# EAGLE design peltier (EAGLE 7.5.0)
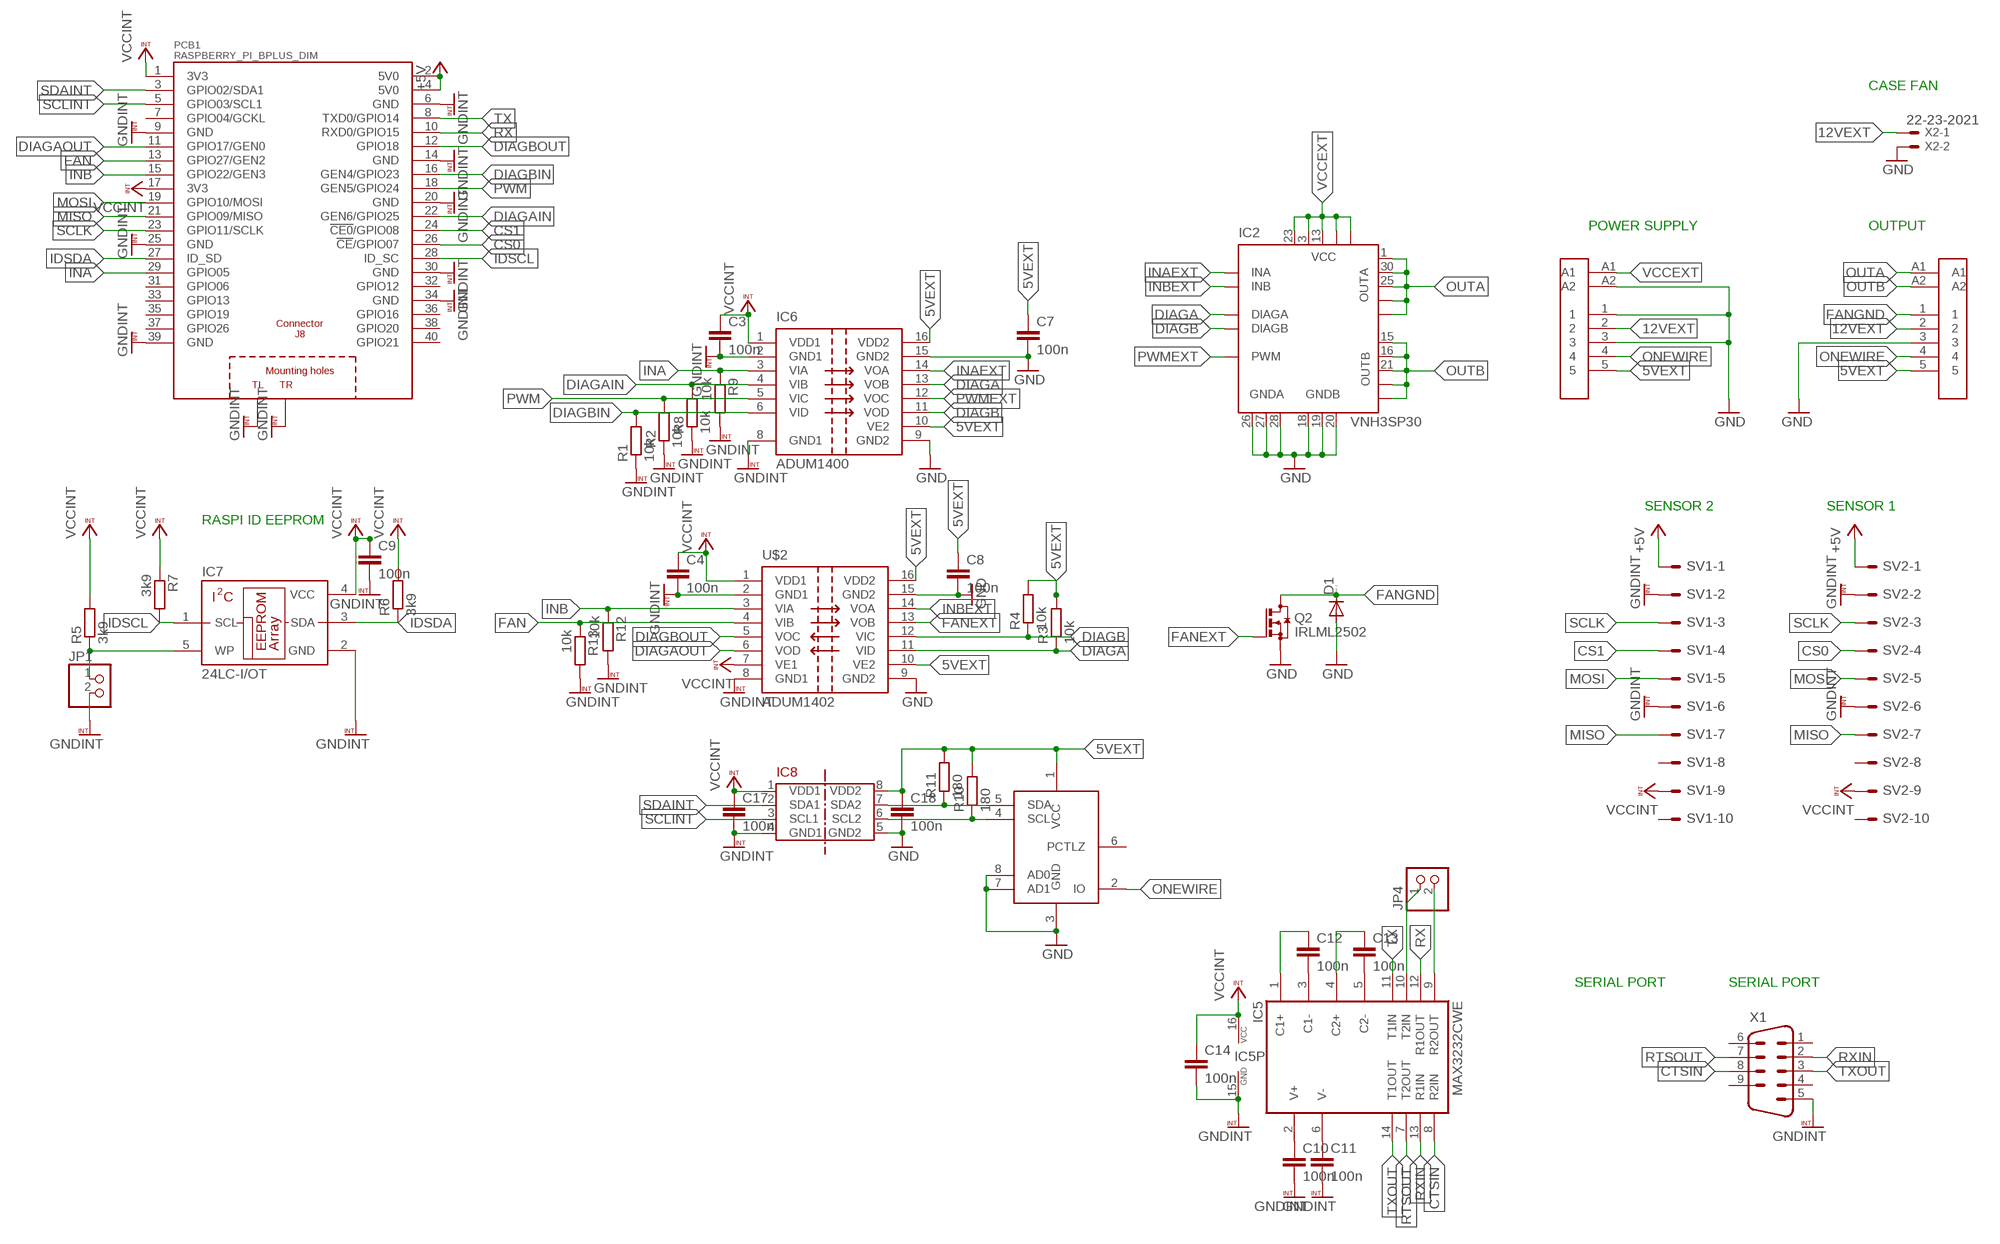
[diagram p0: schematic, sheet 1]

## Parts
C3  100n  C-EUC0805  [C0805]
C4  100n  C-EUC0805  [C0805]
C7  100n  C-EUC0805  [C0805]
C8  100n  C-EUC0805  [C0805]
C9  100n  C-EUC0805  [C0805]
C10  100n  C-EUC0805  [C0805]
C11  100n  C-EUC0805  [C0805]
C12  100n  C-EUC0805  [C0805]
C13  100n  C-EUC0805  [C0805]
C14  100n  C-EUC0805  [C0805]
C17  100n  C-EUC0805  [C0805]
C18  100n  C-EUC0805  [C0805]
D1  DIODE-MINIMELF  [MINIMELF]
IC2  VNH3SP30  [MULTIPOWERSO-30]
IC5  MAX3232CWE  [SO16L]
IC6  ADUM1400  [SO16W]
IC7  24LC-I/OT  [SOT23-5]
IC8  ADUM1250  [SO08]
JP1  PINHD-1X2  [1X02]
JP4  PINHD-1X2  [1X02]
PCB1  RASPBERRY_PI_BPLUS_DIM  [RASPBERRY_PI_BPLUS_DIM]
Q2  IRLML2502  BSS123  [SOT23]
R1  10k  R-EU_R0603  [R0603]
R2  10k  R-EU_R0603  [R0603]
R3  10k  R-EU_R0805  [R0805]
R4  10k  R-EU_R0805  [R0805]
R5  3k9  R-EU_R0805  [R0805]
R6  3k9  R-EU_R0805  [R0805]
R7  3k9  R-EU_R0805  [R0805]
R8  10k  R-EU_R0603  [R0603]
R9  10k  R-EU_R0603  [R0603]
R10  180  R-EU_R0805  [R0805]
R11  180  R-EU_R0805  [R0805]
R12  10k  R-EU_R0603  [R0603]
R13  10k  R-EU_R0603  [R0603]
SV1  ML10E  [ML10]
SV2  ML10E  [ML10]
U$2  ADUM1402  [SO16W]
U$4  7W2-F  [7W2-F]
U$6  7W2-M  [7W2-M]
U$15  DS2483-100  [SO-08]
X1  M09HP  [M09HP]
X2  22-23-2021  [22-23-2021]

## Nets
5VEXT: C7.1 C8.1 C18.1 IC6.10(VE2) IC6.16(VDD2) IC8.8(VDD2) R3.2 R4.2 R10.2 R11.2 U$2.10(VE2) U$2.16(VDD2) U$4.5 U$6.5 U$15.1(VCC)
12VEXT: U$4.2 U$6.2 X2.1
+5V: PCB1.2(5V0) PCB1.4(5V0) SV1.1 SV2.1
CS0: PCB1.26(!CE!/GPIO07) SV2.4
CS1: PCB1.24(!CE0!/GPIO08) SV1.4
CTSIN: IC5.8(R2IN) X1.8
DIAGA: IC2.6(DIAGA) IC6.13(VOB) R3.1 U$2.11(VID)
DIAGAIN: IC6.4(VIB) PCB1.22(GEN6/GPIO25) R8.2
DIAGAOUT: PCB1.11(GPIO17/GEN0) U$2.6(VOD)
DIAGB: IC2.10(DIAGB) IC6.11(VOD) R4.1 U$2.12(VIC)
DIAGBIN: IC6.6(VID) PCB1.16(GEN4/GPIO23) R1.2
DIAGBOUT: PCB1.12(GPIO18) U$2.5(VOC)
FAN: PCB1.13(GPIO27/GEN2) R13.1 U$2.4(VIB)
FANEXT: Q2.1(G) U$2.13(VOB)
FANGND: D1.C Q2.3(D) U$4.1
GND: C7.2 C8.2 C18.2 D1.A IC2.18(GNDB) IC2.19(GNDB) IC2.20(GNDB) IC2.26(GNDA) IC2.27(GNDA) IC2.28(GNDA) IC6.9(GND2) IC6.15(GND2) IC8.5(GND2) Q2.2(S) U$2.9(GND2) U$2.15(GND2) U$4.3 U$6.1 U$6.3 U$6.A2 U$15.3(GND) U$15.7(AD1) U$15.8(AD0) X2.2
GNDINT: C3.2 C4.2 C9.2 C10.2 C11.2 C14.2 C17.2 IC5.15(GND) IC6.2(GND1) IC6.8(GND1) IC7.2(GND) IC8.4(GND1) JP1.2 PCB1.6(GND) PCB1.9(GND) PCB1.14(GND) PCB1.20(GND) PCB1.25(GND) PCB1.30(GND) PCB1.34(GND) PCB1.39(GND) PCB1.PE_TL(TL) PCB1.PE_TR(TR) R1.1 R2.1 R8.1 R9.2 R12.2 R13.2 SV1.2 SV1.6 SV2.2 SV2.6 U$2.2(GND1) U$2.8(GND1) X1.5
IDSCL: IC7.1(SCL) PCB1.28(ID_SC) R7.2
IDSDA: IC7.3(SDA) PCB1.27(ID_SD) R6.1
INA: IC6.3(VIA) PCB1.29(GPIO05) R9.1
INAEXT: IC2.5(INA) IC6.14(VOA)
INB: PCB1.15(GPIO22/GEN3) R12.1 U$2.3(VIA)
INBEXT: IC2.11(INB) U$2.14(VOA)
MISO: PCB1.21(GPIO09/MISO) SV1.7 SV2.7
MOSI: PCB1.19(GPIO10/MOSI) SV1.5 SV2.5
N$28: IC7.5(WP) JP1.1 R5.1
N$59: C10.1 IC5.2(V+)
N$60: C11.1 IC5.6(V-)
N$61: C12.1 IC5.1(C1+)
N$62: C12.2 IC5.3(C1-)
N$63: C13.1 IC5.4(C2+)
N$64: C13.2 IC5.5(C2-)
N$68: IC5.9(R2OUT) JP4.2
N$69: IC5.10(T2IN) JP4.1
N$74: IC8.7(SDA2) R11.1 U$15.5(SDA)
N$75: IC8.6(SCL2) R10.1 U$15.4(SCL)
ONEWIRE: U$4.4 U$6.4 U$15.2(IO)
OUTA: IC2.1(OUTA) IC2.25(OUTA) IC2.30(OUTA) IC2.OUTA IC2.OUTA@1(OUTA) U$4.A1
OUTB: IC2.15(OUTB) IC2.16(OUTB) IC2.21(OUTB) IC2.OUTB IC2.OUTB@1(OUTB) U$4.A2
PWM: IC6.5(VIC) PCB1.18(GEN5/GPIO24) R2.2
PWMEXT: IC2.8(PWM) IC6.12(VOC)
RTSOUT: IC5.7(T2OUT) X1.7
RX: IC5.12(R1OUT) PCB1.10(RXD0/GPIO15)
RXIN: IC5.13(R1IN) X1.2
SCLINT: IC8.3(SCL1) PCB1.5(GPIO03/SCL1)
SCLK: PCB1.23(GPIO11/SCLK) SV1.3 SV2.3
SDAINT: IC8.2(SDA1) PCB1.3(GPIO02/SDA1)
TX: IC5.11(T1IN) PCB1.8(TXD0/GPIO14)
TXOUT: IC5.14(T1OUT) X1.3
VCCEXT: IC2.3(VCC) IC2.13(VCC) IC2.23(VCC) IC2.VCC IC2.VCC@1(VCC) U$6.A1
VCCINT: C3.1 C4.1 C9.1 C14.1 C17.1 IC5.16(VCC) IC6.1(VDD1) IC7.4(VCC) IC8.1(VDD1) PCB1.1(3V3) PCB1.17(3V3) R5.2 R6.2 R7.1 SV1.9 SV2.9 U$2.1(VDD1) U$2.7(VE1)
Unconnected: PCB1.7(GPIO04/GCKL) PCB1.31(GPIO06) PCB1.32(GPIO12) PCB1.33(GPIO13) PCB1.35(GPIO19) PCB1.36(GPIO16) PCB1.37(GPIO26) PCB1.38(GPIO20) PCB1.40(GPIO21) SV1.8 SV1.10 SV2.8 SV2.10 U$15.6(PCTLZ) X1.1 X1.4 X1.6 X1.9

## Notes on the sheet
- CASE FAN
- POWER SUPPLY | OUTPUT
- SENSOR 2 | SENSOR 1
- RASPI ID EEPROM
- SERIAL PORT | SERIAL PORT

## Library data of the parts
C3 C4 C7-C14 C17 C18 = rcl:C-EU: CAPACITOR, European symbol
D1 = diode:DIODE-: DIODE
IC2 = custom:VNH3SP30: FULLY INTEGRATED H-BRIDGE MOTOR DRIVER Source: http://pdf1.alldatasheet.com/datasheet-pdf/view/84563/STMICROELECTRONICS/VNH3SP30.html; MPN: VNH3SP30-E; OC_FARNELL: 1739420; OC_NEWARK: 33R1486
IC5 = maxim:MAX3232*: True RS-232 Transceivers 3.0V to 5.5V, Low-Power up to 1Mbps, Using Four 0.1µF External Capacitors Source: http://pdfserv.maxim-ic.com/en/ds/MAX3222-MAX3241.pdf; MF: MAXIM; MPN: MAX3232CWE+; OC_FARNELL: 9725504; OC_NEWARK: 68K4630
IC6 = adum140x:ADUM1400
IC7 = we-chip:24LC*: Microchip I2C EEPROM 2 Kbit - 24LC02B - 24LC02BT-I/OTDKR-ND 32 Kbit- 24LC32A - 24LC32AT-I/OTDKR-ND; DIGIKEY: 24LC32AT-I/OTDKR-ND
IC8 = Bus-isolators:ADUM1250
JP1 JP4 = pinhead:PINHD-1X2: PIN HEADER
PCB1 = custom:RASPBERRY_PI_BPLUS: Raspberry Pi B+ Basedon issue: Thursday, July 10, 2014 - Rev 1.2 LBR by Tim Rettmann 07-2014
Q2 = transistor-small-signal:BSS123: N-CHANNEL MOS FET
R1-R13 = rcl:R-EU_: RESISTOR, European symbol
SV1 SV2 = con-ml:ML10E: HARTING; OC_FARNELL: unknown; OC_NEWARK: unknown
U$2 = adum140x:ADUM1402
U$4 = conec:7W2-F
U$6 = conec:7W2-M
U$15 = custom:DS2483-100
X1 = con-subd:M09: SUB-D; OC_FARNELL: unknown; OC_NEWARK: unknown
X2 = con-molex:22-23-2021: .100" (2.54mm) Center Header - 2 Pin; MF: MOLEX; MPN: 22-23-2021; OC_FARNELL: 1462926; OC_NEWARK: 25C3832

## Board
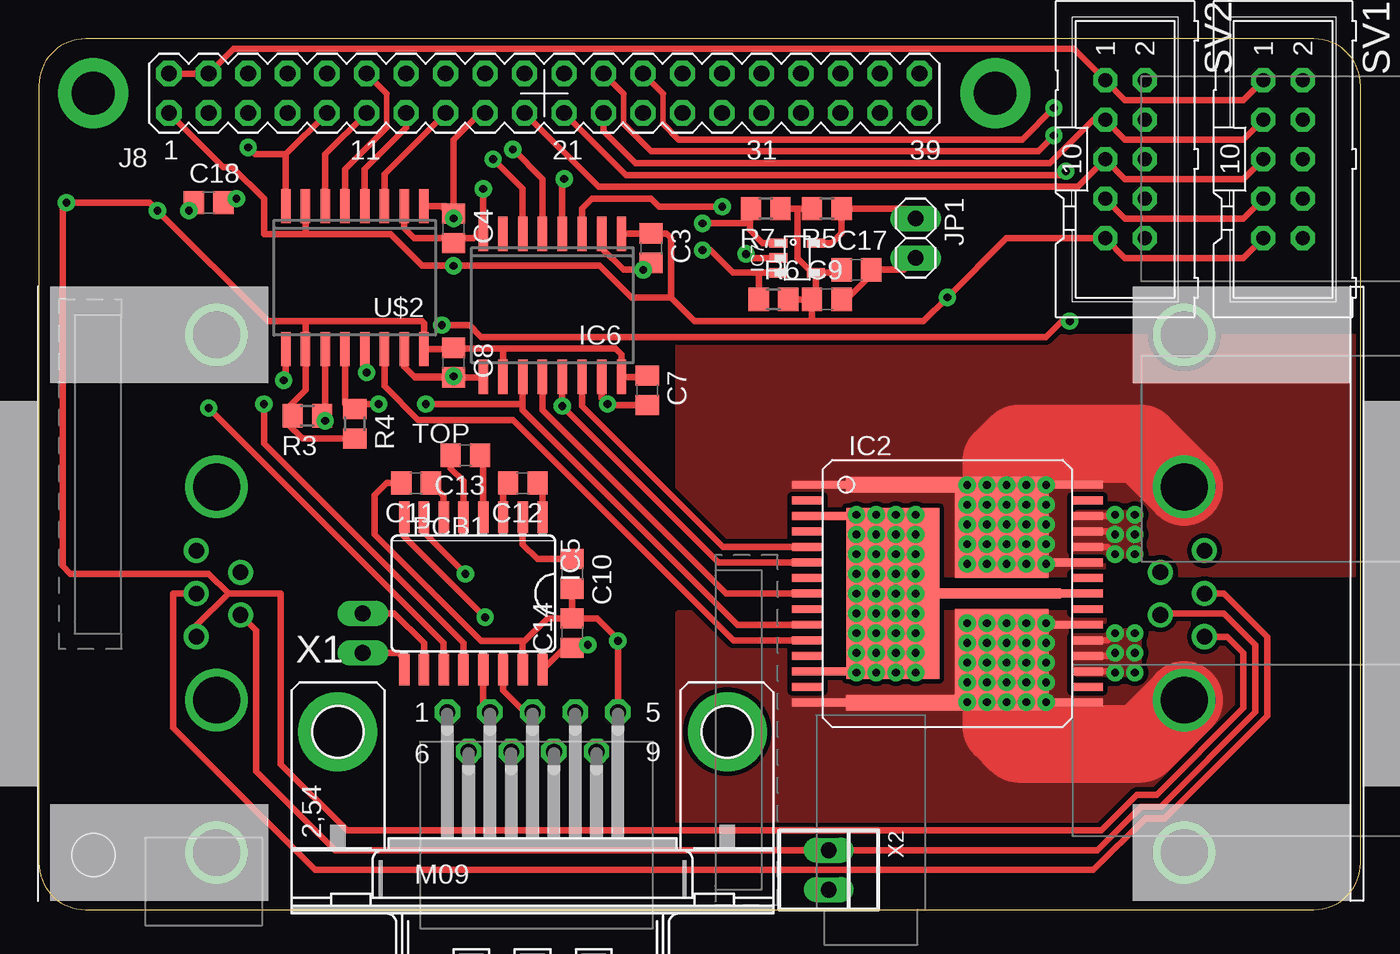
[diagram p1: board, top side]
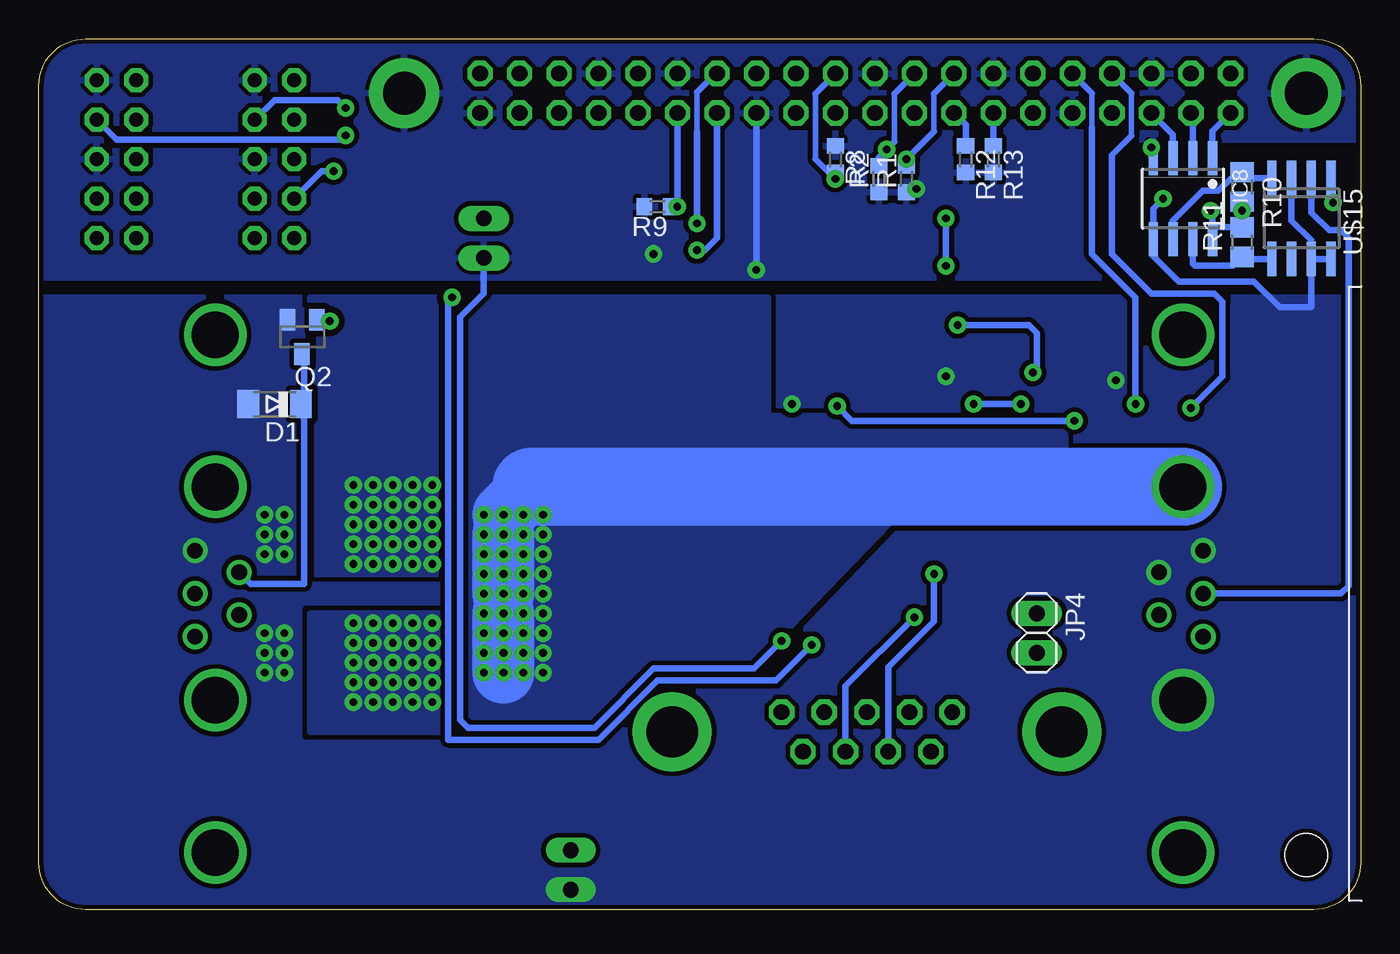
[diagram p2: board, bottom side, seen from below]

Size 85 x 56 mm. Coordinates in mm from the lower left corner, seen from the top.
Outline: 0,3 arc90 3,0 82,0 arc90 85,3 85,53 arc90 82,56 3,56 arc90 0,53
Copper layers (1*16): Top 0.035mm / dielectric 1.5mm / Bottom 0.035mm
Design rules "Standard10_lpt *": minimum track width 10mil, minimum drill 16mil, track to track 10mil, track to pad 10mil, pad to pad 10mil, via to via 10mil, smd to smd 0mil, copper to edge 10mil, drill to drill 8mil, minimum pad ring 12mil, minimum via ring 12mil, stop-mask expansion 0mil, vias tented up to drill 0mil, thermal gap 10mil
Holes 2.75 mm at 3.5,3.5

### Footprints (pad centres in the part's own frame; a part is rotated, then mirrored left to right if it is on the bottom)
C0805 = smd 1.3 x 1.5: 1 -0.95,0; 2 0.95,0
MINIMELF = smd 1.4 x 1.8: A 1.7,0; C -1.7,0
MULTIPOWERSO-30 = smd 0.508 x 12: 1 -7,-4; 15 7,-4; 16 7,4; 30 -7,4 | smd 0.508 x 2: 2 -6,-9; 4 -4,-9; 5 -3,-9; 6 -2,-9; 7 -1,-9; 8 0,-9; 9 1,-9; 10 2,-9; 11 3,-9; 12 4,-9; 14 6,-9; 17 6,9; 18 5,9; 19 4,9; 20 3,9; 22 1,9; 24 -1,9; 26 -3,9; 27 -4,9; 28 -5,9; 29 -6,9 | smd 0.508 x 4: 3 -5,-8; 13 5,-8; 21 2,8; 23 0,8; 25 -2,8 | smd 6.5 x 6: OUTA -4.25,3.5; OUTB 4.25,3.5 | smd 1 x 7.5: OUTA@1 -7,-2.755; OUTB@1 7,-2.755 | smd 11 x 6: VCC 0,-3.5 | smd 0.65 x 8.3: VCC@1 0,3.145
SO16L = smd 0.66 x 2.032: 1 -4.445,-4.902; 2 -3.175,-4.902; 3 -1.905,-4.902; 4 -0.635,-4.902; 5 0.635,-4.902; 6 1.905,-4.902; 7 3.175,-4.902; 8 4.445,-4.902; 9 4.445,4.902; 10 3.175,4.902; 11 1.905,4.902; 12 0.635,4.902; 13 -0.635,4.902; 14 -1.905,4.902; 15 -3.175,4.902; 16 -4.445,4.902
SO16W = smd 0.6 x 2.2: 1 -4.445,-4.6; 2 -3.175,-4.6; 3 -1.905,-4.6; 4 -0.635,-4.6; 5 0.635,-4.6; 6 1.905,-4.6; 7 3.175,-4.6; 8 4.445,-4.6; 9 4.445,4.6; 10 3.175,4.6; 11 1.905,4.6; 12 0.635,4.6; 13 -0.635,4.6; 14 -1.905,4.6; 15 -3.175,4.6; 16 -4.445,4.6
SOT23-5 = smd 1.2 x 0.6: 1 -1.2,0.95; 2 -1.2,0; 3 -1.2,-0.95; 4 1.2,-0.95; 5 1.2,0.95
SO08 = smd 0.6 x 2.2: 1 -1.905,-2.6; 2 -0.635,-2.6; 3 0.635,-2.6; 4 1.905,-2.6; 5 1.905,2.6; 6 0.635,2.6; 7 -0.635,2.6; 8 -1.905,2.6
1X02 = drill 1.016 long: 1 -1.27,0; 2 1.27,0
RASPBERRY_PI_BPLUS_DIM = drill 1.016 octagon: 1 8.37,51.23; 2 8.37,53.77; 3 10.91,51.23; 4 10.91,53.77; 5 13.45,51.23; 6 13.45,53.77; 7 15.99,51.23; 8 15.99,53.77; 9 18.53,51.23; 10 18.53,53.77; 11 21.07,51.23; 12 21.07,53.77; 13 23.61,51.23; 14 23.61,53.77; 15 26.15,51.23; 16 26.15,53.77; 17 28.69,51.23; 18 28.69,53.77; 19 31.23,51.23; 20 31.23,53.77; 21 33.77,51.23; 22 33.77,53.77; 23 36.31,51.23; 24 36.31,53.77; 25 38.85,51.23; 26 38.85,53.77; 27 41.39,51.23; 28 41.39,53.77; 29 43.93,51.23; 30 43.93,53.77; 31 46.47,51.23; 32 46.47,53.77; 33 49.01,51.23; 34 49.01,53.77; 35 51.55,51.23; 36 51.55,53.77; 37 54.09,51.23; 38 54.09,53.77; 39 56.63,51.23; 40 56.63,53.77 | drill 2.75 pad 4.5: PE_TL 3.5,52.5; PE_TR 61.5,52.5
SOT23 = smd 1 x 1.4: 1 -0.95,-1.1; 2 0.95,-1.1; 3 0,1.1
R0603 = smd 1 x 1.1: 1 -0.85,0; 2 0.85,0
R0805 = smd 1.3 x 1.5: 1 -0.95,0; 2 0.95,0
ML10 = drill 0.914 octagon: 1 -5.08,-1.27; 2 -5.08,1.27; 3 -2.54,-1.27; 4 -2.54,1.27; 5 0,-1.27; 6 0,1.27; 7 2.54,-1.27; 8 2.54,1.27; 9 5.08,-1.27; 10 5.08,1.27
7W2-F = drill 1: 1 1.37,1.54; 2 -1.37,1.54; 3 2.77,-1.3; 4 0,-1.3; 5 -2.77,-1.3 | drill 3: A1 6.86,0; A2 -6.86,0; P$1 -16.65,0; P$2 16.65,0
7W2-M = drill 1: 1 -1.37,1.54; 2 1.37,1.54; 3 -2.77,-1.3; 4 0,-1.3; 5 2.77,-1.3 | drill 3: A1 -6.86,0; A2 6.86,0; A3 -16.65,0; A4 16.65,0
SO-08 = smd 0.6 x 2.2: 1 -1.905,-2.6; 2 -0.635,-2.6; 3 0.635,-2.6; 4 1.905,-2.6; 5 1.905,2.6; 6 0.635,2.6; 7 -0.635,2.6; 8 -1.905,2.6
M09HP = drill 1.016 octagon: 1 -5.486,1.27; 2 -2.743,1.27; 3 0,1.27; 4 2.743,1.27; 5 5.486,1.27; 6 -4.115,-1.27; 7 -1.372,-1.27; 8 1.372,-1.27; 9 4.115,-1.27 | drill 3.302 pad 5.08: G1 -12.522,0; G2 12.522,0
22-23-2021 = drill 1 long: 1 -1.27,0; 2 1.27,0

### Placement (x,y rotation side)
C3  39.37,42.55 270 top
C4  26.67,43.81 270 top
C7  39.12,33.4 270 top
C8  26.67,35.18 270 top
C9  50.67,39.24 0 top
C10  34.29,21.59 270 top
C11  24.26,27.43 180 top
C12  31.11,27.43 180 top
C13  27.43,29.21 180 top
C14  34.29,17.78 90 top
C17  52.58,41.15 0 top
C18  10.92,45.47 0 top
D1  69.85,32.51 180 bottom
IC2  58.42,20.32 270 top
IC5  27.94,20.32 180 top
IC6  33.02,38.86 180 top
IC7  48.77,41.91 0 top
IC8  11.43,45.72 180 bottom
JP1  56.39,43.18 270 top
JP4  20.83,17.78 270 bottom
PCB1  0,0 0 top
Q2  68.07,36.83 180 bottom
R1  29.21,46.99 90 bottom
R2  30.99,46.99 90 bottom
R3  17.27,31.75 180 top
R4  20.32,31.24 270 top
R5  50.67,45.09 180 top
R6  47.24,39.24 0 top
R7  46.74,45.09 180 top
R8  33.78,48.26 270 bottom
R9  45.21,45.21 180 bottom
R10  7.62,46.48 270 bottom
R11  7.62,42.93 90 bottom
R12  25.4,48.26 270 bottom
R13  23.62,48.26 270 bottom
SV1  80.01,48.26 270 top
SV2  69.85,48.26 270 top
U$2  20.32,40.64 180 top
U$4  73.66,20.32 90 top
U$6  11.43,20.32 270 top
U$15  3.81,44.45 180 bottom
X1  31.75,11.43 0 top
X2  50.8,2.54 270 top

### Tracks (layer width: path | path; a pad name or v marks a point on that pad's centre or on a via)
5VEXT  (via drill 0.5)
  Top 0.406: v9.65,44.96 9.65,45.15 C18.1 | U$4.5 76.43,17.55 77.47,16.51 77.47,12.95 71.88,7.37 70.61,7.37 68.33,5.08 19.81,5.08 15.56,9.33 15.56,20.32 12.19,20.32 | 29.72,36.07 37.08,36.07 37.47,35.69 IC6.16 39.03,34.26 C7.1 | 29.72,36.07 26.73,36.07 C8.1 26.58,36.04 U$2.16 24.77,37.72 24.64,37.85 17.27,37.85 | IC6.10 29.84,35.94 29.72,36.07 | 17.27,37.85 14.73,37.85 v7.62,44.96 7.11,45.47 v1.78,45.47 1.52,45.21 1.52,22.1 2.03,21.59 10.92,21.59 12.19,20.32 | 17.27,37.85 17.14,37.72 U$2.10 17.14,33.4 16,32.26 16,32.07 R3.2 16,31.43 16,31.24 16.95,30.29 R4.2 | 12.19,20.32 10.13,18.26 U$6.5
  Bottom 0.406: IC8.8 9.53,43.69 | 9.53,43.69 9.53,44.83 v9.65,44.96 | 9.53,43.69 9.34,43.88 R11.2 v7.62,44.96 R10.2 | U$15.1 1.91,45.59 v1.78,45.47
12VEXT
  Top 0.406: U$6.2 13.97,17.95 13.97,8.89 19.05,3.81 X2.1 68.07,3.81 70.87,6.6 72.14,6.6 78.23,12.7 78.23,17.02 76.2,19.05 72.22,19.05 U$4.2
+5V
  Top 0.406: PCB1.2 PCB1.4 12.51,55.37 66.55,55.37 SV2.1 69.85,52.07 77.47,52.07 SV1.1
CS0  (via drill 0.5)
  Top 0.356: 40.13,50.55 40.13,52.49
  Top 0.406: v65.28,51.56 63.25,49.53 41.15,49.53 40.13,50.55 | 40.13,52.49 PCB1.26
  Bottom 0.406: SV2.4 69.85,52.07 65.79,52.07 v65.28,51.56
CS1  (via drill 0.5)
  Top 0.356: 37.59,50.55 37.59,52.49
  Top 0.406: v65.28,49.78 64.26,48.77 39.37,48.77 37.59,50.55 | 37.59,52.49 PCB1.24
  Bottom 0.406: SV1.4 80.01,49.53 65.53,49.53 v65.28,49.78
CTSIN  (via drill 0.5)
  Top 0.406: IC5.8 23.5,24 v28.7,18.8
  Bottom 0.406: X1.8 33.12,14.38 v28.7,18.8
DIAGA  (via drill 0.5)
  Top 0.406: IC2.6 43.72,22.32 v33.66,32.38 IC6.13 | U$2.11 v18.41,31.43 18.22,31.63 R3.1
  Bottom 0.406: v33.66,32.38 32.7,31.43 v18.41,31.43
DIAGAIN  (via drill 0.5)
  Top 0.406: IC6.4 33.66,46.86 v33.78,46.99
  Bottom 0.356: 35.05,48.26 35.05,52.49
  Bottom 0.406: 35.05,48.26 v33.78,46.99 R8.2 | 35.05,52.49 PCB1.22
DIAGAOUT
  Top 0.406: U$2.6 18.41,48.58 PCB1.11
DIAGB  (via drill 0.5)
  Top 0.406: IC2.10 44.93,18.32 31.11,32.13 IC6.11 31.11,32.64 30.99,32.51 v24.89,32.51 | v21.84,32.51 20,32.51 | U$2.12 19.68,32.51 20,32.51 | 20.32,32.51 R4.1 20,32.51
  Bottom 0.406: v24.89,32.51 v21.84,32.51
DIAGBIN  (via drill 0.5)
  Top 0.406: IC6.6 31.11,46.35 v29.21,48.26
  Bottom 0.356: 27.43,50.04 27.43,52.49
  Bottom 0.406: 27.43,50.04 v29.21,48.26 R1.2 | 27.43,52.49 PCB1.16
DIAGBOUT
  Top 0.356: 22.35,50.29 22.35,52.49
  Top 0.406: U$2.5 19.68,47.62 22.35,50.29 | 22.35,52.49 PCB1.12
FAN
  Top 0.406: U$2.4 20.95,47.62 23.61,50.28 PCB1.13
  Bottom 0.406: R13.1 PCB1.13
FANEXT  (via drill 0.5)
  Top 0.406: v25.91,37.59 27.69,37.59 28.45,36.83 64.77,36.83 65.79,37.85 v66.29,37.85 | U$2.13 20.95,34.67 v21.08,34.54
  Bottom 0.406: v25.91,37.59 21.34,37.59 20.83,37.08 20.83,34.8 v21.08,34.54 | v66.29,37.85 67.04,37.85 Q2.1
FANGND
  Bottom 0.406: 67.94,32.72 67.94,20.95 71.39,20.95 U$4.1 | Q2.3 67.94,35.6 67.94,32.72 | 67.94,32.72 D1.C
GND  (via drill 0.5)
  Top 0.406: IC2.26 68.75,23.32 v69.22,22.86 | IC2.27 69.03,24.32 v69.22,24.13 | IC2.28 69.14,25.32 v69.22,25.4 | IC2.19 69.03,16.32 v69.22,16.51 | IC2.18 69.14,15.32 v69.22,15.24 | IC2.20 68.75,17.32 v69.22,17.78 | v12.7,45.72 12.13,45.72 C18.2 | U$2.9 15.88,34.16 v15.75,34.04 | IC6.9 28.54,34.23 C8.2 24.19,34.23 24.13,34.29 | U$2.15 23.5,34.92 24.13,34.29 | 24.13,34.29 v26.67,34.29 | IC6.15 36.2,32.89 v36.58,32.51 36.64,32.45 C7.2
  Bottom 0.406: v12.7,45.72 13.34,45.09 IC8.5 13.34,42.04 11.68,40.39 6.86,40.39 5.21,38.73 3.17,38.73 U$15.7 | U$15.8 U$15.7 | U$15.7 3.17,43.05 4.45,44.32 U$15.3
  other vias: 70.48,16.51 70.48,15.24 70.48,17.78 70.48,22.86 70.48,24.13 70.48,25.4
  pour Bottom (isolate 0.305, rank 2, no thermals): 0,39.37 85.09,39.37 85.09,0 0,0
  pour Top (isolate 0.305, no thermals): 66.8,17.78 70.61,17.78 70.61,15.24 66.8,15.24
  pour Top (no thermals): 66.8,25.4 70.61,25.4 70.61,22.86 66.8,22.86
GNDINT  (via drill 0.5)
  Top 0.406: v28.57,46.35 IC6.8 28.57,43.81 27.94,43.18 26.98,43.18 C4.2 26.36,43.18 24.13,43.18 23.5,43.81 U$2.2 | C10.2 C14.2 | C3.2 39.31,41.59 v38.86,41.15 37.59,41.15 36.2,42.55 IC6.2 | IC7.2 45.72,41.91 v45.47,42.16 | C9.2 51.94,39.24 53.34,40.64 53.34,40.96 C17.2 55.63,41.15 JP1.2 | U$2.8 15.88,48.58 | 15.88,48.58 PCB1.9 | 15.88,48.58 13.91,48.58 v13.46,49.02 | C14.2 32.7,18.73 31.24,17.27 | 31.24,17.27 31.11,17.14 IC5.15 | X1.5 v37.24,17.27 37.24,17.37 35.88,18.73 C14.2 | C11.2 22.35,27.43 21.59,26.67 21.59,24.13 28.45,17.27 31.24,17.27
  Bottom 0.406: v38.86,41.15 38.86,51.22 PCB1.25 | v13.46,49.02 13.46,48.45 IC8.4 | JP1.2 56.39,39.62 57.91,38.1 57.91,12.19 57.4,11.68 49.28,11.68 45.47,15.49 39.01,15.49 v37.24,17.27
  pour Bottom (isolate 0.305): 0,55.88 0,49.53 15.24,49.53 15.24,40.64 85.09,40.64 85.09,55.88
IDSCL  (via drill 0.5)
  Top 0.406: IC7.1 46.55,42.86 45.72,43.69 45.72,44.45 | 45.72,44.45 45.72,45.02 R7.2 | v42.67,44.13 45.41,44.13 45.72,44.45
  Bottom 0.356: 42.67,52.58 42.67,50.04
  Bottom 0.406: PCB1.28 41.48,53.77 42.67,52.58 | 42.67,50.04 v42.67,44.13
IDSDA  (via drill 0.5)
  Top 0.406: IC7.3 46.23,40.96 | v42.67,42.42 43.18,42.42 44.64,40.96 46.23,40.96 | 46.23,40.96 46.29,40.89 R6.1
  Bottom 0.406: v42.67,42.42 42.16,42.42 41.4,43.18 41.4,51.22 PCB1.27
INA  (via drill 0.5)
  Top 0.406: 34.92,42.55 IC6.3 34.92,45.09 35.56,45.72 39.37,45.72 39.88,45.21 v43.94,45.21
  Bottom 0.406: PCB1.29 43.94,51.22 43.94,45.72 v43.94,45.21 R9.1
INAEXT
  Top 0.406: IC2.5 43.99,23.32 34.92,32.38 IC6.14
INB
  Top 0.406: U$2.3 22.23,47.3 PCB1.15
  Bottom 0.406: R12.1 25.4,50.48 PCB1.15
INBEXT
  Top 0.406: IC2.11 44.66,17.32 30.48,31.5 24.38,31.5 22.23,33.66 U$2.14
MISO  (via drill 0.5)
  Top 0.406: SV1.7 77.47,44.45 69.85,44.45 SV2.7 | v66.04,47.5 65.79,47.24 37.76,47.24 PCB1.21
  Bottom 0.406: SV2.7 66.8,47.5 v66.04,47.5
MOSI
  Top 0.406: SV1.5 77.47,46.99 69.85,46.99 SV2.5 66.8,46.48 35.98,46.48 PCB1.19
N$28
  Top 0.406: IC7.5 50.99,42.86 51.62,43.49 R5.1 55.75,45.09 JP1.1
N$59
  Top 0.406: IC5.2 31.11,23.5 32.07,22.54 C10.1
N$60
  Top 0.406: IC5.6 26.04,26.6 C11.1
N$61
  Top 0.406: IC5.1 32.38,27.11 C12.1
N$62
  Top 0.406: IC5.3 29.84,27.11 C12.2
N$63
  Top 0.406: IC5.4 28.57,29.02 C13.1
N$64
  Top 0.406: IC5.5 27.3,27.56 26.48,28.38 C13.2
N$68
  Top 0.406: JP4.2 23.11,16.51 23.37,16.26 23.37,15.54 IC5.9
N$69
  Top 0.406: IC5.10 24.77,17.14 22.86,19.05 JP4.1
N$74
  Bottom 0.406: IC8.7 10.79,41.53 10.67,41.4 8.19,41.4 R11.1 7.49,41.85 U$15.5
N$75
  Bottom 0.406: IC8.6 12.06,44.32 10.16,46.23 9.14,46.23 8.38,46.99 8.06,46.99 R10.1 7.24,47.05 U$15.4
ONEWIRE
  Top 0.406: U$4.4 76.2,20.32 78.99,17.53 78.99,12.45 72.39,5.84 71.12,5.84 67.82,2.54 17.78,2.54 8.64,11.68 8.64,20.32 U$6.4
  Bottom 0.406: U$15.2 3.17,44.83 2.03,43.69 1.27,43.69 0.76,43.18 0.76,20.83 1.27,20.32 U$6.4
OUTA  (via drill 0.5)
  Top 0.406: IC2.1 IC2.OUTA@1 59.67,27.32 v59.69,27.3 | IC2.25 64.86,22.32 v64.77,22.23 | IC2.OUTA 62.03,24.57 v62.23,24.77
  Top 5: IC2.OUTA 61.92,28.9 62.99,29.97 70.87,29.97 U$4.A1
  other vias: 59.69,22.23 60.96,27.3 62.23,27.3 63.5,27.3 59.69,26.04 60.96,26.04 62.23,26.04 63.5,26.04 64.77,26.04 59.69,24.77 60.96,24.77 63.5,24.77 64.77,24.77 59.69,23.5 60.96,23.5 62.23,23.5 63.5,23.5 64.77,23.5 60.96,22.23 62.23,22.23 63.5,22.23 64.77,27.3
  pour Bottom (isolate 0.406): 67.56,39.37 67.56,21.59 58.93,21.59 58.93,39.37
  pour Top (isolate 0.305, rank 2, no thermals): 41.15,36.83 85.09,36.83 85.09,21.59 41.15,21.59
OUTB  (via drill 0.5)
  Top 0.406: IC2.15 IC2.OUTB@1 | IC2.OUTB@1 59.04,13.32 59.69,13.97 | IC2.OUTB@1 59.67,13.32 v59.69,13.34 | IC2.21 64.86,18.32 v64.77,18.41 | v62.23,15.88 62.12,15.88 IC2.OUTB
  Top 5: U$4.A2 70.87,10.67 62.99,10.67 61.92,11.74 IC2.OUTB
  other vias: 64.77,13.34 59.69,18.41 60.96,18.41 62.23,18.41 63.5,18.41 59.69,17.14 60.96,17.14 62.23,17.14 63.5,17.14 64.77,17.14 59.69,15.88 60.96,15.88 63.5,15.88 64.77,15.88 59.69,14.61 60.96,14.61 62.23,14.61 60.96,13.34 62.23,13.34 63.5,13.34 63.5,14.61 64.77,14.61
  pour Bottom (isolate 0.305): 67.56,19.05 67.56,11.43 58.93,11.43 58.93,19.05
  pour Top (isolate 0.305, rank 2, no thermals): 41.15,19.05 82.55,19.05 82.55,0 41.15,0
PWM  (via drill 0.5)
  Top 0.406: IC6.5 32.38,46.99 v30.48,48.9
  Bottom 0.356: 29.97,49.4 29.97,52.49
  Bottom 0.406: 29.97,49.4 v30.48,48.9 30.99,48.39 R2.2 | 29.97,52.49 PCB1.18
PWMEXT
  Top 0.406: IC6.12 32.38,32.13 44.2,20.32 IC2.8
RTSOUT  (via drill 0.5)
  Top 0.406: IC5.7 24.77,24.26 v27.43,21.59
  Bottom 0.406: X1.7 30.38,15.6 27.43,18.54 v27.43,21.59
RX  (via drill 0.5)
  Top 0.406: IC5.12 27.3,17.14 14.48,29.97 v14.48,32.51
  Bottom 0.356: 17.27,50.29 17.27,52.51
  Bottom 0.406: 17.27,50.29 17.27,42.16 14.48,39.37 v14.48,32.51 | 17.27,52.51 PCB1.10
RXIN
  Top 0.406: IC5.13 28.57,13.13 X1.2
SCLINT
  Bottom 0.406: IC8.3 12.06,49.84 PCB1.5
SCLK
  Top 0.406: SV1.3 77.47,49.53 69.85,49.53 SV2.3 67.82,50.8 65.02,48.01 38.35,48.01 36.31,50.05 PCB1.23
SDAINT
  Bottom 0.406: IC8.2 10.79,51.12 PCB1.3
TX  (via drill 0.5)
  Top 0.406: IC5.11 26.04,17.14 v10.92,32.26
  Bottom 0.356: 14.73,49.78 14.73,52.51
  Bottom 0.406: 14.73,49.78 16,48.51 16,42.16 13.46,39.62 9.4,39.62 8.89,39.12 8.89,34.29 v10.92,32.26 | 14.73,52.51 PCB1.8
TXOUT
  Top 0.406: X1.3 31.24,12.7 29.84,14.1 IC5.14
VCCEXT  (via drill 0.5)
  Top 0.406: IC2.13 52.5,15.32 v52.58,15.24 | IC2.3 52.5,25.32 v52.58,25.4 | v56.39,20.32 IC2.VCC@1 IC2.23 | IC2.VCC v55.12,20.32 v55.12,19.05
  Bottom 4: v55.12,15.24 v55.12,16.51 v55.12,17.78 v55.12,19.05 | v55.12,20.32 v55.12,21.59 v55.12,22.86 v55.12,24.13 | 53.34,27.18 v55.12,25.4
  Bottom 5: U$6.A1 53.34,27.18
  other vias: 56.39,25.4 53.85,25.4 52.58,24.13 53.85,24.13 56.39,24.13 56.39,22.86 53.85,22.86 52.58,22.86 52.58,21.59 53.85,21.59 56.39,21.59 52.58,20.32 53.85,20.32 56.39,19.05 53.85,19.05 52.58,19.05 52.58,17.78 53.85,17.78 56.39,17.78 56.39,16.51 53.85,16.51 52.58,16.51 56.39,15.24 53.85,15.24
  pour Bottom (isolate 0.305): 19.05,31.75 38.1,31.75 38.1,39.37 57.66,39.37 57.66,11.43 43.18,11.43 30.23,24.89 18.8,24.89
VCCINT  (via drill 0.5)
  Top 0.406: C9.1 R6.2 48.13,39.24 | IC7.4 49.97,39.49 C9.1 | R7.1 48.77,45.09 | 48.77,45.09 R5.2 | IC7.4 49.72,40.96 48.77,41.91 48.77,45.09 | C3.1 39.4,43.46 IC6.1 40.36,43.46 40.64,43.18 40.64,39.37 | SV1.9 77.47,41.91 69.85,41.91 SV2.9 62.23,43.18 v58.42,39.37 56.9,37.85 49.53,37.85 | PCB1.17 28.37,51.23 26.67,49.53 C4.1 26.2,45.24 U$2.1 25.88,45.24 v26.67,44.45 | IC7.4 51.44,40.96 C17.1 | IC5.16 33.8,16.83 C14.1 34.48,17.02 v35.31,17.02 | 49.53,37.85 42.16,37.85 40.64,39.37 | 40.64,39.37 38.1,39.37 36.07,41.4 v26.67,41.4 24.64,41.4 22.61,43.43 17.27,43.43 | PCB1.1 11.85,47.75 12.45,47.75 14.48,45.72 14.48,43.43 17.27,43.43 | U$2.7 17.14,43.56 17.27,43.43 | C9.1 49.72,38.04 49.53,37.85
  Bottom 0.406: IC8.1 9.53,50.08 PCB1.1 | v58.42,39.37 58.67,39.12 58.67,10.92 49.02,10.92 45.21,14.73 37.59,14.73 v35.31,17.02 | v26.67,44.45 v26.67,41.4

### Text on the board
Measures: modular connector | modular connector